# EAGLE design treiber (EAGLE 9.6.2)
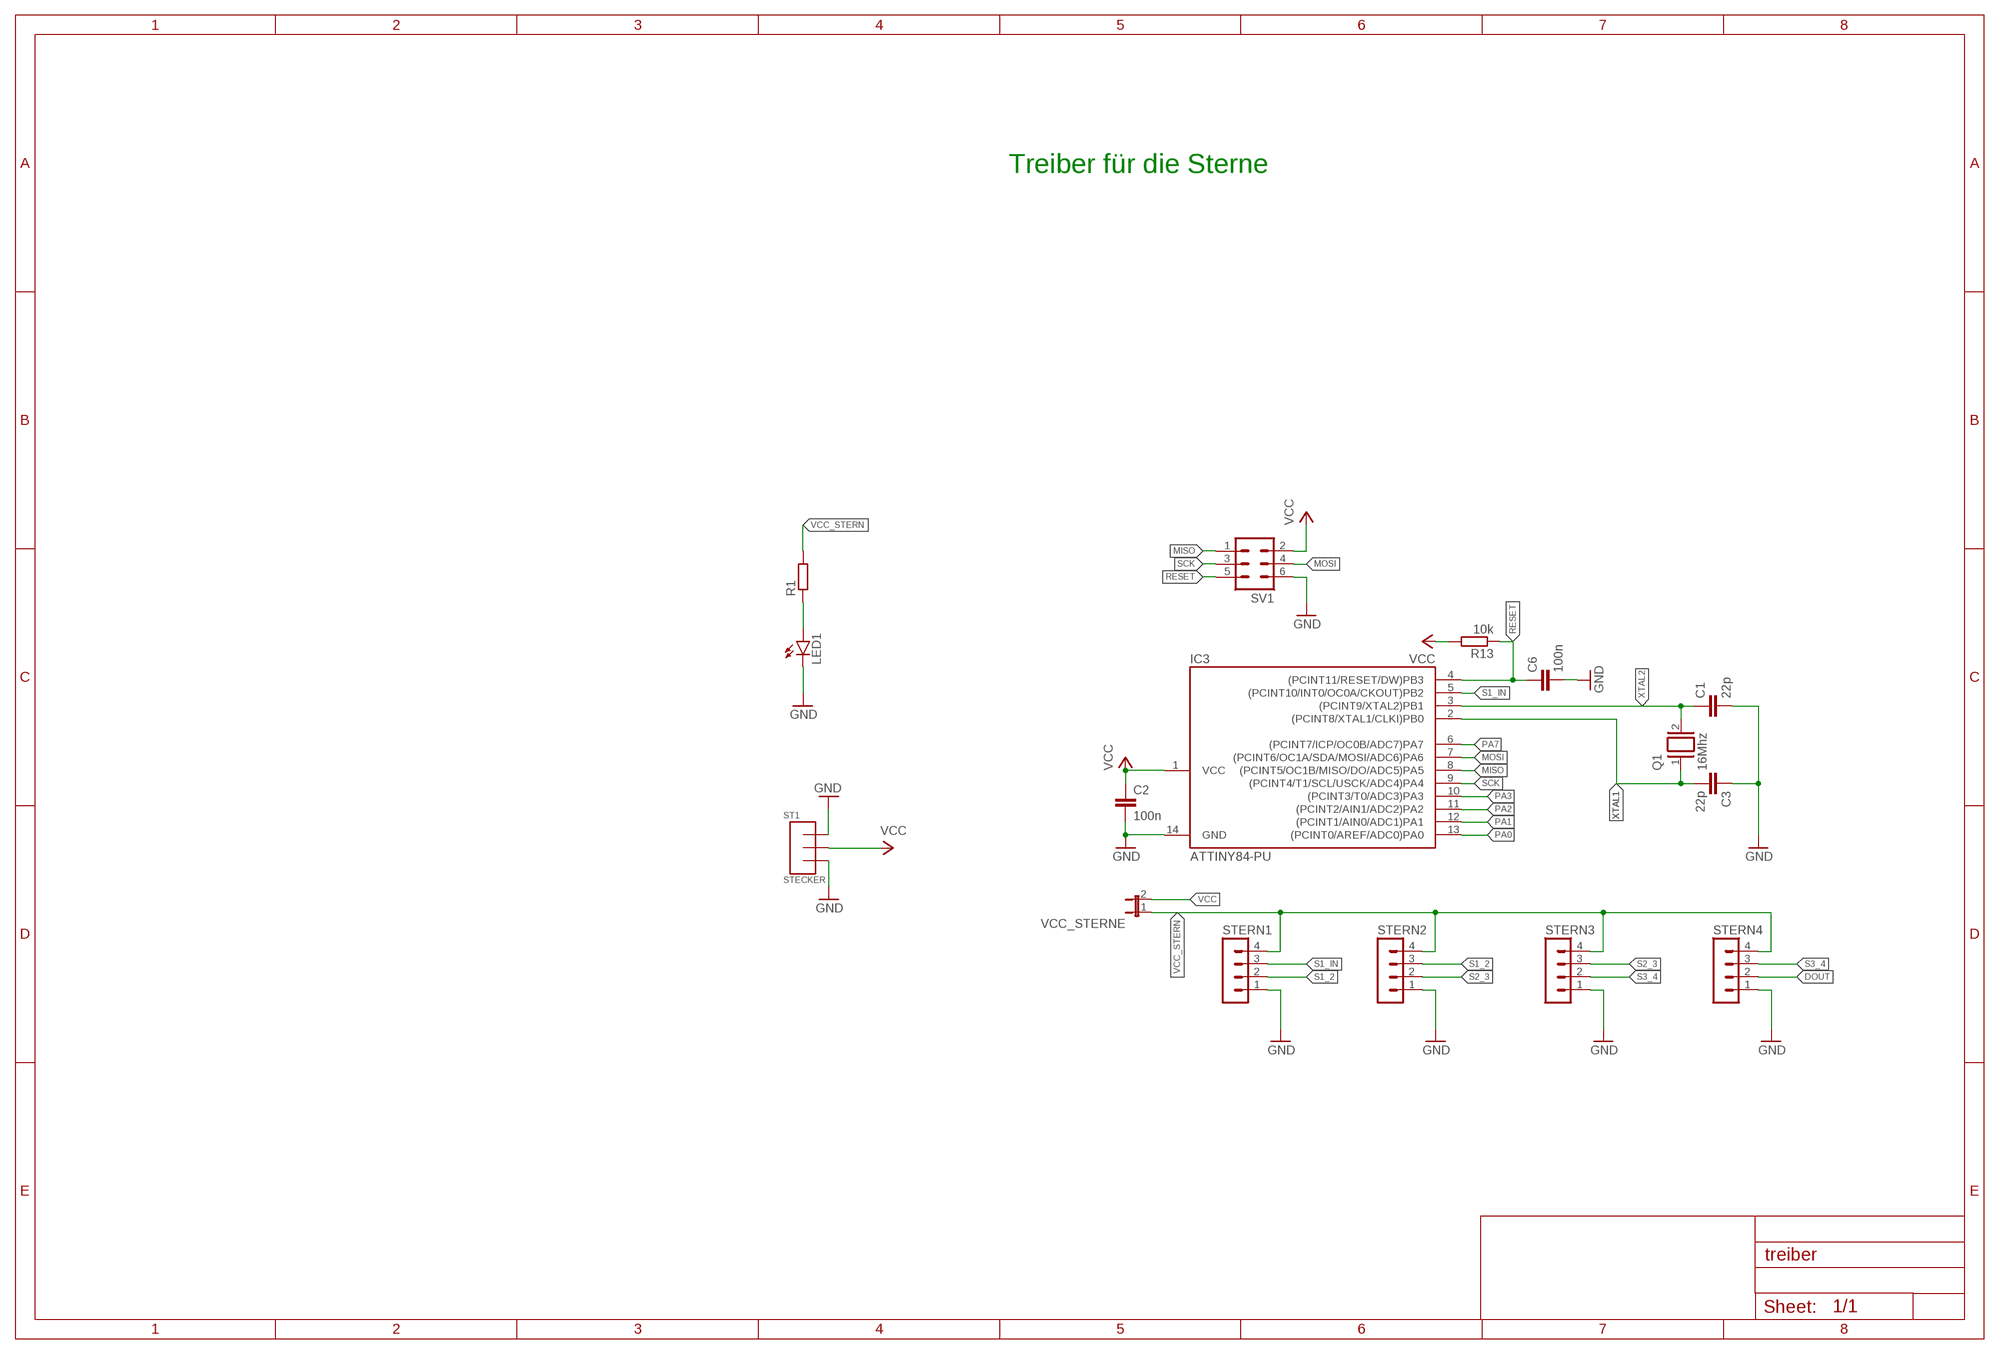
[diagram p0: schematic, sheet 1]

## Parts
C1  22p  C-EU025-024X044  [C025-024X044]
C2  100n  C-EUC0805  [C0805]
C3  22p  C-EU025-024X044  [C025-024X044]
C6  100n  C-EUC0805  [C0805]
IC3  ATTINY84-PU  ATTINY24/44/84-PU  [DIL14]
LED1  LEDSML0805  [SML0805]
Q1  16Mhz  XTAL/S  [QS]
R1  R-EU_R0805  [R0805]
R13  10k  R-EU_R0805  [R0805]
ST1  STECKER  [STROMSTECKER]
STERN1  MA04-1  [MA04-1]
STERN2  MA04-1  [MA04-1]
STERN3  MA04-1  [MA04-1]
STERN4  MA04-1  [MA04-1]
SV1  MA03-2  [MA03-2]
VCC_STERNE  JP1E  [JP1]

## Nets
DOUT: STERN4.2
GND: C1.2 C2.2 C3.1 C6.2 IC3.14(GND) LED1.C ST1.LINKS ST1.RECHTS STERN1.1 STERN2.1 STERN3.1 STERN4.1 SV1.6
MISO: IC3.8((PCINT5/OC1B/MISO/DO/ADC5)PA5) SV1.1
MOSI: IC3.7((PCINT6/OC1A/SDA/MOSI/ADC6)PA6) SV1.4
N$3: LED1.A R1.1
PA0: IC3.13((PCINT0/AREF/ADC0)PA0)
PA1: IC3.12((PCINT1/AIN0/ADC1)PA1)
PA2: IC3.11((PCINT2/AIN1/ADC2)PA2)
PA3: IC3.10((PCINT3/T0/ADC3)PA3)
PA7: IC3.6((PCINT7/ICP/OC0B/ADC7)PA7)
RESET: C6.1 IC3.4((PCINT11/RESET/DW)PB3) R13.1 SV1.5
S1_2: STERN1.2 STERN2.3
S1_IN: IC3.5((PCINT10/INT0/OC0A/CKOUT)PB2) STERN1.3
S2_3: STERN2.2 STERN3.3
S3_4: STERN3.2 STERN4.3
SCK: IC3.9((PCINT4/T1/SCL/USCK/ADC4)PA4) SV1.3
VCC: C2.1 IC3.1(VCC) R13.2 ST1.INNEN SV1.2 VCC_STERNE.2
VCC_STERN: R1.2 STERN1.4 STERN2.4 STERN3.4 STERN4.4 VCC_STERNE.1
XTAL1: C3.2 IC3.2((PCINT8/XTAL1/CLKI)PB0) Q1.1
XTAL2: C1.1 IC3.3((PCINT9/XTAL2)PB1) Q1.2

## Notes on the sheet
- Treiber für die Sterne

## Library data of the parts
C1-C3 C6 = rcl:C-EU: CAPACITOR, European symbol; SPICEPREFIX: C
IC3 = attiny24_44_84:ATTINY24/44/84
LED1 = led:LED: LED OSRAM: - CHIPLED LG R971, LG N971, LY N971, LG Q971, LY Q971, LO R971, LY R971 LH N974, LH R974 LS Q976, LO Q976, LY Q976 LO Q996 - Hyper CHIPLED LW Q18S LB Q993, LB Q99A, LB R99A - SideLED LS A670, LO A670, LY A670, LG A670, LP A670 LB A673, LV A673, LT A673, LW A673 LH A674 LY A675 LS A676, LA A676, LO A676, LY A676, LW A676 LS A679, LY A679, LG A679 - Hyper Micro SIDELED® LS Y876, LA Y876, LO Y876, LY Y876 LT Y87S - SmartLED LW L88C, LW L88S LB L89C, LB L89S, LG L890 LS L89K, LO L89K, LY L89K LS L896, LA L896, LO L896, LY L896 - TOPLED LS T670, LO T670, LY T670, LG T670, LP T670 LSG T670, LSP T670, LSY T670, LOP T670, LYG T670 LG T671, LOG T671, LSG T671 LB T673, LV T673, LT T673, LW T673 LH T674 LS T676, LA T676, LO T676, LY T676, LB T676, LH T676, LSB T676, LW T676 LB T67C, LV T67C, LT T67C, LS T67K, LO T67K, LY T67K, LW E67C LS E67B, LA E67B, LO E67B, LY E67B, LB E67C, LV E67C, LT E67C LW T67C LS T679, LY T679, LG T679 LS T770, LO T770, LY T770, LG T770, LP T770 LB T773, LV T773, LT T773, LW T773 LH T774 LS E675, LA E675, LY E675, LS T675 LS T776, LA T776, LO T776, LY T776, LB T776 LHGB T686 LT T68C, LB T68C - Hyper Mini TOPLED® LB M676 - Mini TOPLED Santana® LG M470 LS M47K, LO M47K, LY M47K Source: http://www.osram.convergy.de LUXEON: - LUMILED® LXK2-PW12-R00, LXK2-PW12-S00, LXK2-PW14-U00, LXK2-PW14-V00 LXK2-PM12-R00, LXK2-PM12-S00, LXK2-PM14-U00 LXK2-PE12-Q00, LXK2-PE12-R00, LXK2-PE12-S00, LXK2-PE14-T00, LXK2-PE14-U00 LXK2-PB12-K00, LXK2-PB12-L00, LXK2-PB12-M00, LXK2-PB14-N00, LXK2-PB14-P00, LXK2-PB14-Q00 LXK2-PR12-L00, LXK2-PR12-M00, LXK2-PR14-Q00, LXK2-PR14-R00 LXK2-PD12-Q00, LXK2-PD12-R00, LXK2-PD12-S00 LXK2-PH12-R00, LXK2-PH12-S00 LXK2-PL12-P00, LXK2-PL12-Q00, LXK2-PL12-R00 Source: www.luxeon.com KINGBRIGHT: KA-3528ASYC Source: www.kingbright.com
Q1 = special:XTAL/S: CRYSTAL
R1 R13 = rcl:R-EU_: RESISTOR, European symbol; SPICEPREFIX: R
ST1 = MeineBibliothek:STECKER: Stromstecker Stromstecker AMAZON B00O9YHQ64
STERN1-STERN4 = con-eigen:MA04-1: PIN HEADER; OC_FARNELL: unknown; OC_NEWARK: unknown
SV1 = con-lstb:MA03-2: PIN HEADER; OC_FARNELL: unknown; OC_NEWARK: unknown
VCC_STERNE = jumper:JP1E: JUMPER

## Net classes
0 default: width 0.152 mm, drill 0.305 mm, clearance 0.254 mm

## Board
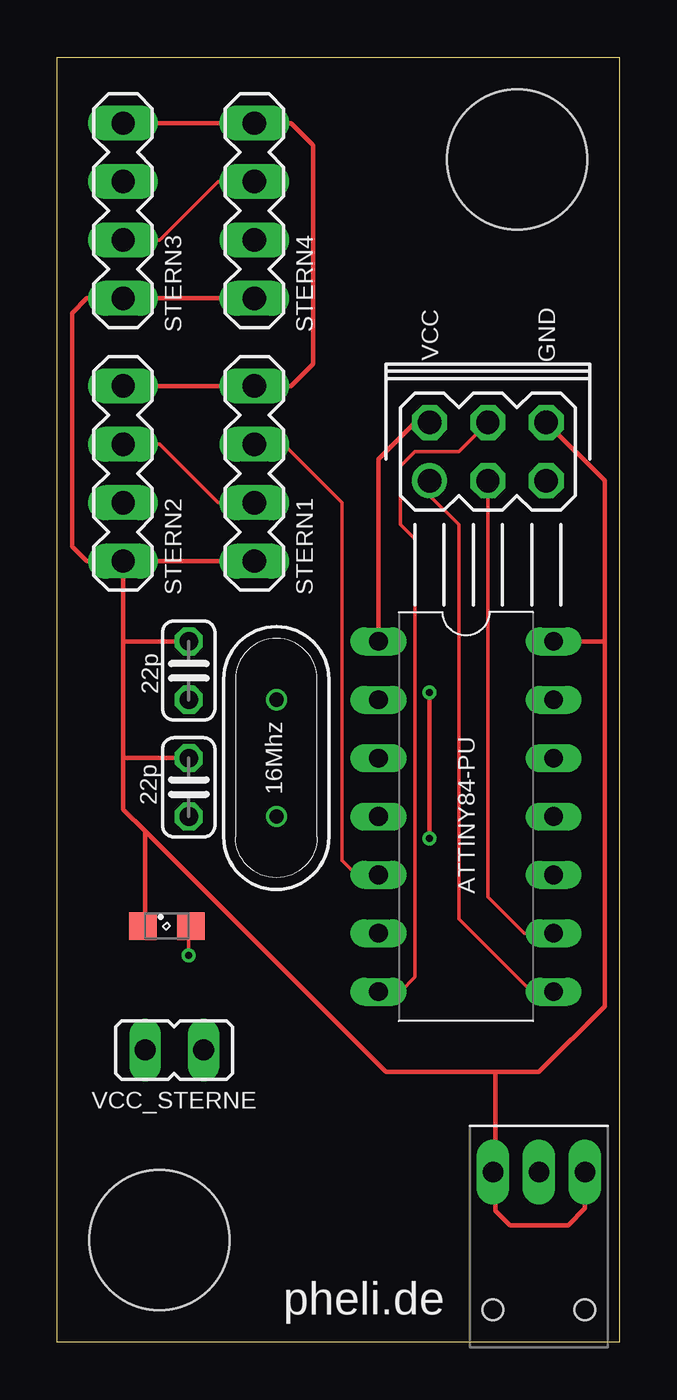
[diagram p1: board, top side]
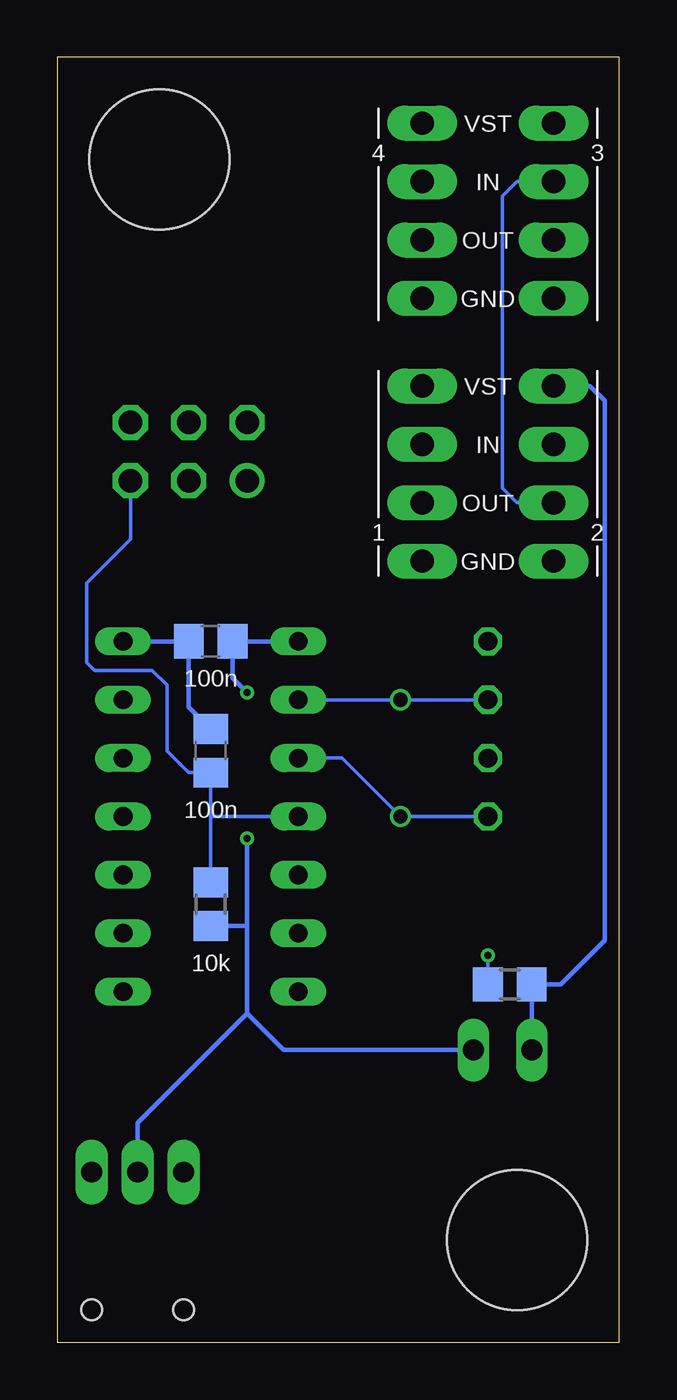
[diagram p2: board, bottom side, seen from below]

Size 24.45 x 55.88 mm. Coordinates in mm from the lower left corner, seen from the top.
Outline: 0,0 0,55.88 24.45,55.88 24.45,0 0,0
Copper layers (1*16): Top 0.035mm / dielectric 1.6mm / Bottom 0.035mm
Design rules "Elecrow_2-layer_PCB_eagle_rule": minimum track width 6mil, minimum drill 12mil, track to track 6mil, track to pad 6mil, pad to pad 6mil, via to via 8mil, smd to smd 0mil, copper to edge 20mil, drill to drill 10mil, minimum pad ring 6mil, minimum via ring 6mil, stop-mask expansion 0mil, vias tented up to drill 100mil, thermal gap 10mil
Holes 6.1 mm at 20,51.44 4.45,4.45

### Footprints (pad centres in the part's own frame; a part is rotated, then mirrored left to right if it is on the bottom)
C025-024X044 = drill 0.813 octagon: 1 -1.27,0; 2 1.27,0
C0805 = smd 1.3 x 1.5: 1 -0.95,0; 2 0.95,0
DIL14 = drill 0.813 long: 1 -7.62,-3.81; 2 -5.08,-3.81; 3 -2.54,-3.81; 4 0,-3.81; 5 2.54,-3.81; 6 5.08,-3.81; 7 7.62,-3.81; 8 7.62,3.81; 9 5.08,3.81; 10 2.54,3.81; 11 0,3.81; 12 -2.54,3.81; 13 -5.08,3.81; 14 -7.62,3.81
SML0805 = smd 1.2 x 1.2: A 1.05,0; C -1.05,0
QS = drill 0.61: 1 -2.54,0; 2 2.54,0
R0805 = smd 1.3 x 1.5: 1 -0.95,0; 2 0.95,0
STROMSTECKER = drill 0.9 pad 1.422 long: INNEN 0,2; LINKS -2,2; RECHTS 2,2 | hole 0.9: -2,-4; 2,-4
MA04-1 = drill 1.016 long: 1 -3.81,0; 2 -1.27,0; 3 1.27,0; 4 3.81,0
MA03-2 = drill 1.016: 1 -2.54,-1.27 | drill 1.016 octagon: 2 -2.54,1.27; 3 0,-1.27; 4 0,1.27; 5 2.54,-1.27; 6 2.54,1.27
JP1 = drill 0.914 long: 1 0,-1.27; 2 0,1.27

### Placement (x,y rotation side)
C1  5.71,24.13 90 top
C2  17.78,30.48 180 bottom
C3  5.71,29.21 270 top
C6  17.78,25.72 90 bottom
IC3  17.78,22.86 270 top
LED1  4.76,18.1 0 top
Q1  9.52,25.4 270 top
R1  4.76,15.56 0 bottom
R13  17.78,19.05 270 bottom
ST1  20.95,5.4 0 top
STERN1  8.57,37.78 90 top
STERN2  2.86,37.78 90 top
STERN3  2.86,49.21 90 top
STERN4  8.57,49.21 90 top
SV1  18.73,38.73 0 top
VCC_STERNE  5.08,12.7 270 top

### Tracks (layer width: path | path; a pad name or v marks a point on that pad's centre or on a via)
GND
  Top 0.203: 23.81,30.48 23.81,14.61 20.95,11.75 19.05,11.75 | STERN4.1 STERN3.1 1.27,45.4 0.63,44.77 0.63,34.61 1.27,33.97 STERN2.1 | STERN1.1 STERN2.1 | 19.05,11.75 14.29,11.75 3.81,22.23 | IC3.14 23.81,30.48 | C1.2 2.86,25.4 | SV1.6 23.81,37.47 23.81,30.48 | C3.1 2.86,30.48 | ST1.RECHTS 22.95,5.81 22.23,5.08 19.69,5.08 19.05,5.71 19.05,7.3 | STERN2.1 2.86,30.48 | 2.86,30.48 2.86,25.4 | 2.86,25.4 2.86,23.18 3.81,22.23 | LED1.C 3.81,18.2 3.81,22.23 | 19.05,7.3 19.05,11.75 | ST1.LINKS 19.05,7.3
  Bottom 0.203: IC3.14 C2.2 18.73,27.62 C6.2
MISO
  Top 0.152: IC3.8 20.64,15.24 17.46,18.41 17.46,35.56 16.19,36.83 SV1.1
MOSI
  Top 0.152: IC3.7 14.92,15.24 15.56,15.87 15.56,34.92 14.92,35.56 14.92,38.1 15.56,38.73 17.46,38.73 SV1.4
N$3  (via drill 0.3)
  Top 0.152: v5.71,16.83 5.71,18 LED1.A
  Bottom 0.152: R1.1 v5.71,16.82 v5.71,16.83
RESET
  Bottom 0.152: 17.78,22.86 C6.1 18.73,24.77 19.69,25.72 19.69,28.58 20.32,29.21 22.82,29.21 23.18,29.57 23.18,33.02 21.27,34.92 SV1.5 | 17.78,22.86 R13.1 | 17.78,22.86 IC3.4
S1_2
  Top 0.152: STERN1.2 6.98,36.51 4.45,39.05 STERN2.3
S1_IN
  Top 0.152: IC3.5 13.02,20.32 12.38,20.96 12.38,36.51 9.84,39.05 STERN1.3
S2_3
  Bottom 0.152: STERN2.2 4.45,36.51 5.08,37.15 5.08,49.85 4.45,50.48 STERN3.3
S3_4
  Top 0.152: STERN3.2 4.45,47.94 6.98,50.48 STERN4.3
SCK
  Top 0.152: IC3.9 20.32,17.78 18.73,19.37 SV1.3
VCC  (via drill 0.3)
  Top 0.203: v16.19,21.91 v16.19,28.26 | SV1.2 15.56,40.01 13.97,38.42 IC3.1
  Bottom 0.203: IC3.1 C2.1 16.83,28.9 v16.19,28.26 | 17.14,18.1 R13.2 16.19,18.1 | ST1.INNEN 20.95,9.53 16.19,14.29 | v16.19,21.91 16.19,18.1 | 16.19,18.1 16.19,14.29 | VCC_STERNE.2 14.6,12.7 16.19,14.29
VCC_STERN
  Top 0.203: STERN3.4 STERN4.4 10.16,53.02 11.11,52.07 11.11,42.55 10.16,41.59 STERN1.4 STERN2.4
  Bottom 0.203: STERN2.4 1.27,41.59 0.63,40.96 0.63,17.46 2.54,15.56 R1.2 VCC_STERNE.1
XTAL1
  Bottom 0.152: IC3.2 Q1.1 C3.2
XTAL2
  Bottom 0.152: IC3.3 12.06,25.4 Q1.2 C1.1

### Text on the board
tPlace: VCC | GND | pheli.de
bPlace: VST | 3 | 4 | IN | OUT | GND | VST | IN | OUT | 2 | 1 | GND